# Altium schematic sheet SH4 - MICROCONTROLLER.SchDoc: Microcontroller
size B; CheckedBy: Lance Bantoto; Engineer: Wolfgang Windholtz; Organization: UW Robotics; Address1: 200 University Avenue; Address2: Waterloo; Address3: Ontario; Address4: Canada N2L 3G6; Revision: 2; SheetNumber: 4; SheetTotal: 5
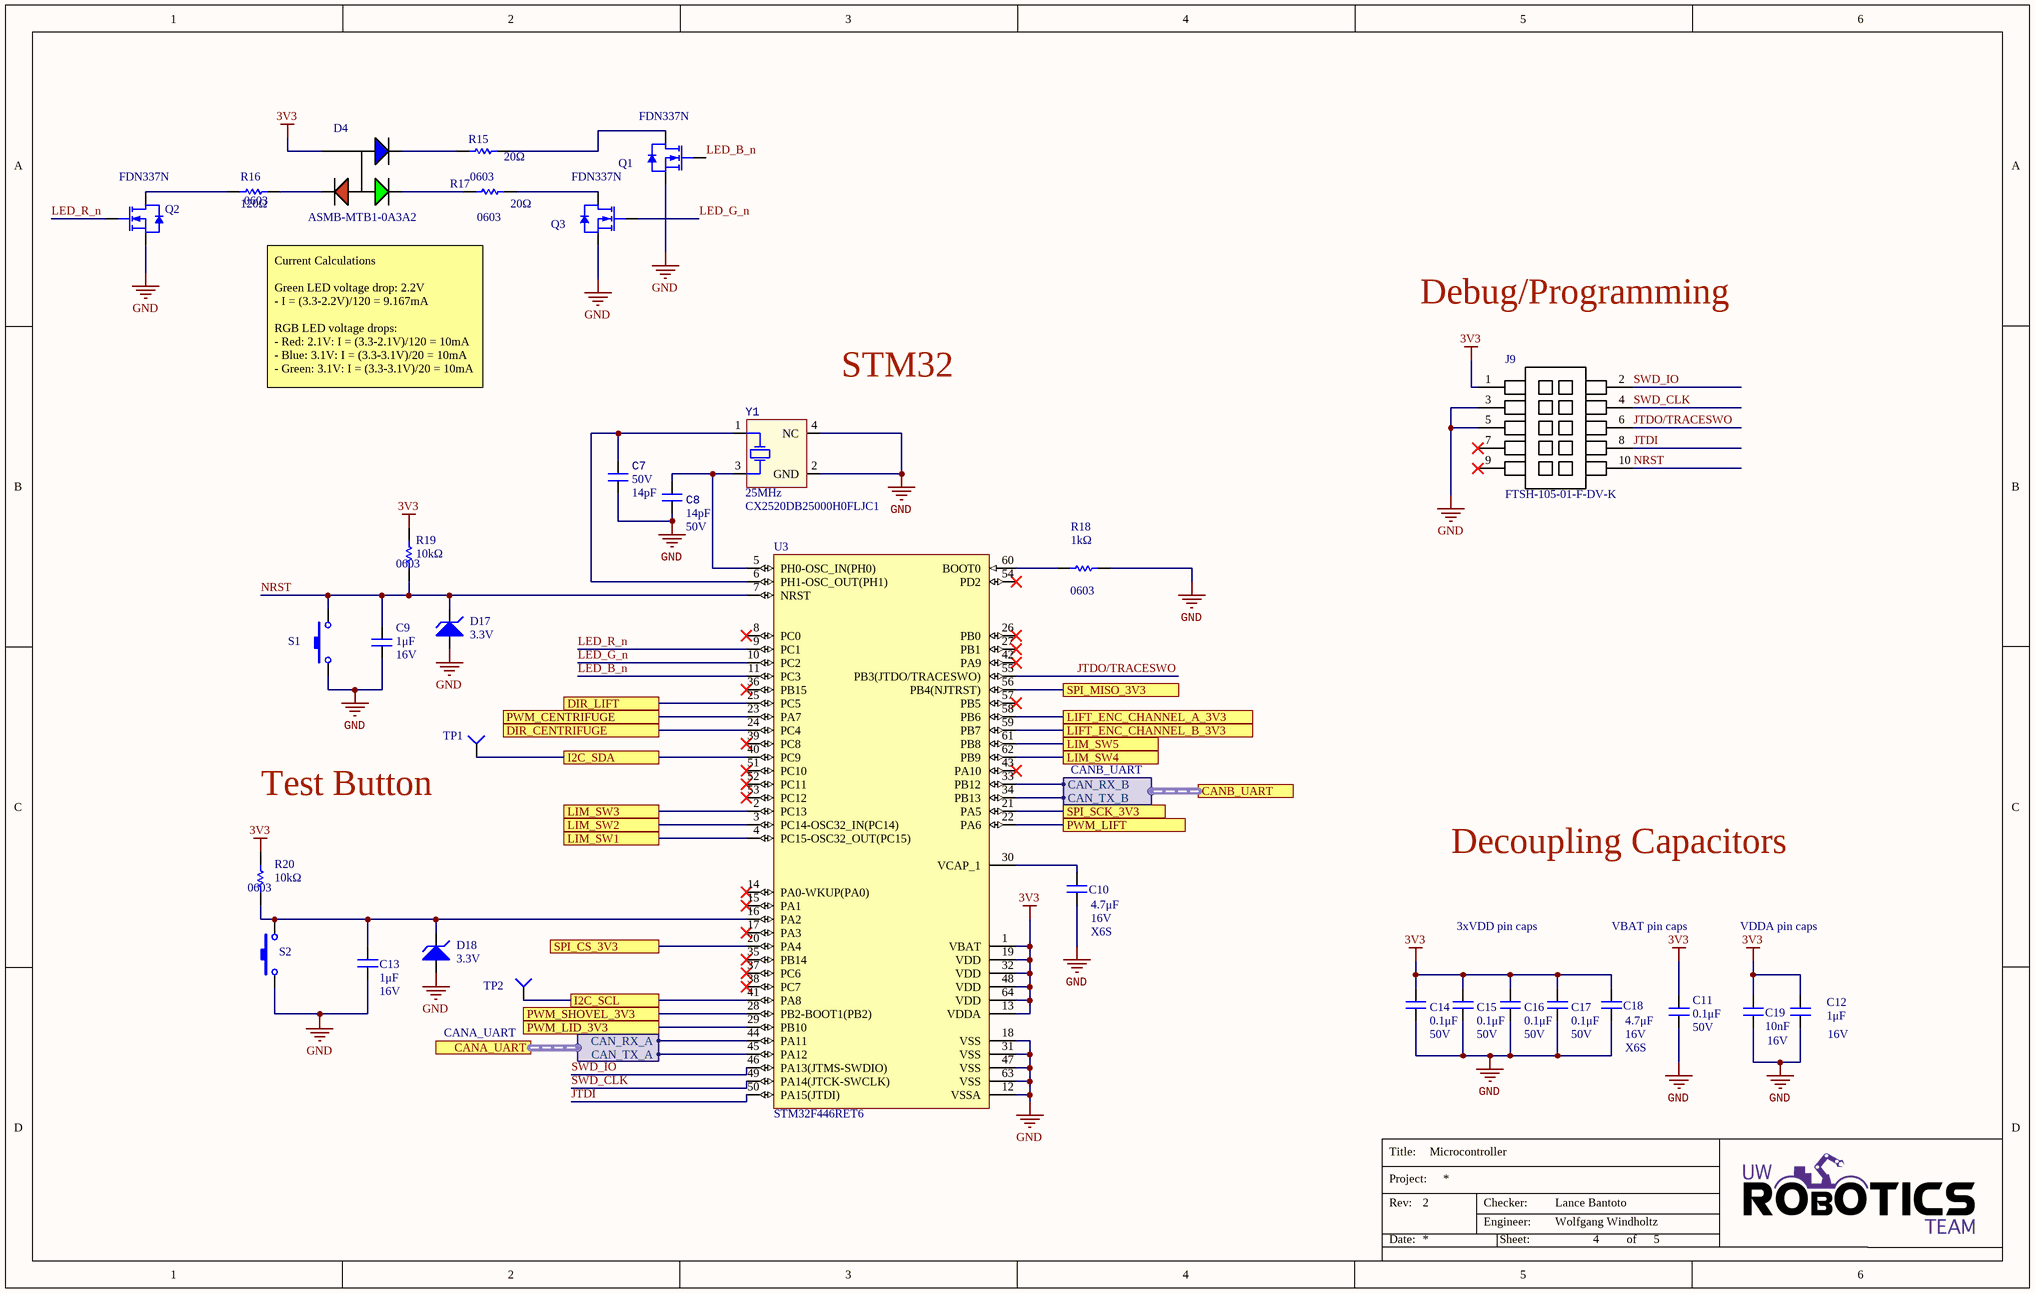
[diagram p0: SH4 - MICROCONTROLLER.SchDoc]

## Parts
C7  value 14pF  Voltage Rating: 50V  [CAP0603]  (hidden comment: CAP_14pF_50V_0603)
C8  value 14pF  Voltage Rating: 50V  [CAP0603]  (hidden comment: CAP_14pF_50V_0603)
C9  value 1μF  Voltage Rating: 16V  [CAP0603]  (hidden comment: CAP_1uF_16V_0603)
C10  value 4.7μF  Dielectric: X6S  Voltage Rating: 16V  [CAP0603]  (hidden comment: CAP_4.7uF_16V_0603)
C11  value 0.1μF  Voltage Rating: 50V  [CAP0603]  (hidden comment: CAP_0.1uF_50V_0603)
C12  value 1μF  Voltage Rating: 16V  [CAP0603]  (hidden comment: CAP_1uF_16V_0603)
C13  value 1μF  Voltage Rating: 16V  [CAP0603]  (hidden comment: CAP_1uF_16V_0603)
C14  value 0.1μF  Voltage Rating: 50V  [CAP0603]  (hidden comment: CAP_0.1uF_50V_0603)
C15  value 0.1μF  Voltage Rating: 50V  [CAP0603]  (hidden comment: CAP_0.1uF_50V_0603)
C16  value 0.1μF  Voltage Rating: 50V  [CAP0603]  (hidden comment: CAP_0.1uF_50V_0603)
C17  value 0.1μF  Voltage Rating: 50V  [CAP0603]  (hidden comment: CAP_0.1uF_50V_0603)
C18  value 4.7μF  Dielectric: X6S  Voltage Rating: 16V  [CAP0603]  (hidden comment: CAP_4.7uF_16V_0603)
C19  value 10nF  Voltage Rating: 16V  [CAP0603]  (hidden comment: CAP_10nF_0603)
D4  Manufacturer Part Number 1: ASMB-MTB1-0A3A2  [LED_RGB]  (hidden comment: LED_RGB)
D17  Reverse Standoff Voltage: 3.3V  [SOD523_UNI]  (hidden comment: ESD5Z3.3T1G)
D18  Reverse Standoff Voltage: 3.3V  [SOD523_UNI]  (hidden comment: ESD5Z3.3T1G)
J9  Manufacturer Part Number 1: FTSH-105-01-F-DV-K  [FTSH-105-01-F-DV-K-P-TR]  (hidden comment: CON_PROGRAMMING)
Q1  Manufacturer Part Number 1: FDN337N  [NMOS_SSOT-3]  (hidden comment: NMOS_30V_2.2A)
Q2  Manufacturer Part Number 1: FDN337N  [NMOS_SSOT-3]  (hidden comment: NMOS_30V_2.2A)
Q3  Manufacturer Part Number 1: FDN337N  [NMOS_SSOT-3]  (hidden comment: NMOS_30V_2.2A)
R15  value 20Ω  Package/Footprint: 0603  [RESC0603]  (hidden comment: RES_20Ω_0603_5%)
R16  value 120Ω  Package/Footprint: 0603  [RESC0603]  (hidden comment: RES_120Ω_0603)
R17  value 20Ω  Package/Footprint: 0603  [RESC0603]  (hidden comment: RES_20Ω_0603_5%)
R18  value 1kΩ  Package/Footprint: 0603  [RESC0603]  (hidden comment: RES_1kΩ_0603_5%)
R19  value 10kΩ  Package/Footprint: 0603  [RESC0603]  (hidden comment: RES_10kΩ_0603_5%)
R20  value 10kΩ  Package/Footprint: 0603  [RESC0603]  (hidden comment: RES_10kΩ_0603_5%)
S1  SW_TACTILE  [B3U-1000P]  (value not drawn)
S2  SW_TACTILE  [B3U-1000P]  (value not drawn)
TP1  TESTPOINT_1MM_CIRCLE  [TESTPOINT_CIRCLE_1MM]  (value not drawn)  (no BOM)
TP2  TESTPOINT_1MM_CIRCLE  [TESTPOINT_CIRCLE_1MM]  (value not drawn)  (no BOM)
U3  STM32F446RET6  [STM-LQFP64_L]
Y1  Frequency: 25MHz  Manufacturer Part Number 1: CX2520DB25000H0FLJC1  [SOIC254P1016X440-4N]  (hidden comment: CRYSTAL_25MHZ)

## Ports
CANA_UART (harness CANA_UART), CANB_UART (harness CANB_UART), DIR_CENTRIFUGE, DIR_LIFT, I2C_SCL, I2C_SDA, LIFT_ENC_CHANNEL_A_3V3, LIFT_ENC_CHANNEL_B_3V3, LIM_SW1, LIM_SW2, LIM_SW3, LIM_SW4, LIM_SW5, PWM_CENTRIFUGE, PWM_LID_3V3, PWM_LIFT, PWM_SHOVEL_3V3, SPI_CS_3V3, SPI_MISO_3V3, SPI_SCK_3V3

## Harnesses
CANA_UART: CAN_RX_A, CAN_TX_A
CANB_UART: CAN_RX_B, CAN_TX_B

## Nets
3V3: C11.2 C12.2 C14.2 C15.2 C16.2 C17.2 C18.2 C19.2 D4.4(COMMON_ANODE) J9.1 R19.2 R20.2 U3.1(VBAT) U3.13(VDDA) U3.19(VDD) U3.32(VDD) U3.48(VDD) U3.64(VDD)
GND: C7.1 C8.1 C9.1 C10.1 C11.1 C12.1 C13.1 C14.1 C15.1 C16.1 C17.1 C18.1 C19.1 D17.1(Anode) D18.1(Anode) J9.3 J9.5 Q1.2(SOURCE) Q2.2(SOURCE) Q3.2(SOURCE) R18.2 S1.2 S2.1 U3.12(VSSA) U3.18(VSS) U3.31(VSS) U3.47(VSS) U3.63(VSS) Y1.2(GND) Y1.4(NC)
DIR_CENTRIFUGE: U3.24(PC4) ; port DIR_CENTRIFUGE
DIR_LIFT: U3.25(PC5) ; port DIR_LIFT
I2C_SCL: TP2.1(=value) U3.41(PA8) ; port I2C_SCL
I2C_SDA: TP1.1(=value) U3.40(PC9) ; port I2C_SDA
JTDI: J9.8 U3.50(PA15(JTDI))
JTDO/TRACESWO: J9.6 U3.55(PB3(JTDO/TRACESWO))
LED_B_n: Q1.1(GATE) U3.11(PC3)
LED_G_n: Q3.1(GATE) U3.10(PC2)
LED_R_n: Q2.1(GATE) U3.9(PC1)
LIFT_ENC_CHANNEL_A_3V3: U3.58(PB6) ; port LIFT_ENC_CHANNEL_A_3V3
LIFT_ENC_CHANNEL_B_3V3: U3.59(PB7) ; port LIFT_ENC_CHANNEL_B_3V3
LIM_SW1: U3.4(PC15-OSC32_OUT(PC15)) ; port LIM_SW1
LIM_SW2: U3.3(PC14-OSC32_IN(PC14)) ; port LIM_SW2
LIM_SW3: U3.2(PC13) ; port LIM_SW3
LIM_SW4: U3.62(PB9) ; port LIM_SW4
LIM_SW5: U3.61(PB8) ; port LIM_SW5
NRST: C9.2 D17.2(Cathode) J9.10 R19.1 S1.1 U3.7(NRST)
PWM_CENTRIFUGE: U3.23(PA7) ; port PWM_CENTRIFUGE
PWM_LID_3V3: U3.29(PB10) ; port PWM_LID_3V3
PWM_LIFT: U3.22(PA6) ; port PWM_LIFT
PWM_SHOVEL_3V3: U3.28(PB2-BOOT1(PB2)) ; port PWM_SHOVEL_3V3
SPI_CS_3V3: U3.20(PA4) ; port SPI_CS_3V3
SPI_MISO_3V3: U3.56(PB4(NJTRST)) ; port SPI_MISO_3V3
SPI_SCK_3V3: U3.21(PA5) ; port SPI_SCK_3V3
SWD_CLK: J9.4 U3.49(PA14(JTCK-SWCLK))
SWD_IO: J9.2 U3.46(PA13(JTMS-SWDIO))
NetC7_2: C7.2 U3.6(PH1-OSC_OUT(PH1)) Y1.1(HOT)
NetC8_2: C8.2 U3.5(PH0-OSC_IN(PH0)) Y1.3(HOT)
NetC10_2: C10.2 U3.30(VCAP_1)
NetC13_2: C13.2 D18.2(Cathode) R20.1 S2.2 U3.16(PA2)
NetD4_1: D4.1(CATHODE_(RED)) R16.2
NetD4_2: D4.2(CATHODE_(GREEN)) R17.1
NetD4_3: D4.3(CATHODE_(BLUE)) R15.1
NetQ1_3: Q1.3(DRAIN) R15.2
NetQ2_3: Q2.3(DRAIN) R16.1
NetQ3_3: Q3.3(DRAIN) R17.2
NetR18_1: R18.1 U3.60(BOOT0)
NetU3_33: U3.33(PB12) ; port CANB_UART.CAN_RX_B
NetU3_34: U3.34(PB13) ; port CANB_UART.CAN_TX_B
NetU3_44: U3.44(PA11) ; port CANA_UART.CAN_RX_A
NetU3_45: U3.45(PA12) ; port CANA_UART.CAN_TX_A

Not connected (* = marked no-connect by the designer): J9 7* 9*; U3 8(PC0)* 14(PA0-WKUP(PA0))* 15(PA1)* 17(PA3)* 26(PB0)* 27(PB1)* 35(PB14)* 36(PB15)* 37(PC6)* 38(PC7)* 39(PC8)* 42(PA9)* 43(PA10)* 51(PC10)* 52(PC11)* 53(PC12)* 54(PD2)* 57(PB5)*

## Notes on the sheet
- Debug/Programming
- Current Calculations
  Green LED voltage drop: 2.2V
  - I = (3.3-2.2V)/120 = 9.167mA
  RGB LED voltage drops:
  - Red: 2.1V: I = (3.3-2.1V)/120 = 10mA
  - Blue: 3.1V: I = (3.3-3.1V)/20 = 10mA
  - Green: 3.1V: I = (3.3-3.1V)/20 = 10mA
- STM32
- (near TP1) Test Button
- Decoupling Capacitors
- 3xVDD pin caps
- VBAT pin caps
- VDDA pin caps
- Title:
- Project:
- Date:
- Rev:
- Checker:
- Engineer:
- Sheet:
- of

## Library data of the parts
C7 C8 = CAP_14pF_50V_0603: CAP CER 14PF 50V C0G/NP0 0603; Manufacturer 1: Samsung; Manufacturer Part Number 1: CL10C140JB8NNNC; Dielectric: C0G; Package/Footprint: 0603; Supplier 1: Digi-Key; Supplier Part Number 1: 1276-2187-1-ND; Mounting Type: SMD
C9 C13 = CAP_1uF_16V_0603: CAP CER 1UF 16V Y5V 0603; Manufacturer 1: Yageo; Manufacturer Part Number 1: CC0603ZRY5V7BB105; Package/Footprint: 0603; Dielectric: Y5V; Supplier 1: Digi-Key; Supplier Part Number 1: 311-1372-1-ND; Package: 0603 (1608 Metric); Manufacturer Part Number: CC0603ZRY5V7BB105; Dimensions: 0.063" L x 0.031" W (1.60mm x 0.80mm); Temperature Coefficient: Y5V; Mounting Type: SMD
C10 C18 = CAP_4.7uF_16V_0603: CAP CER 4.7UF 16V X6S 0603; Manufacturer Part Number 1: GRM188C81C475KE11D; Manufacturer 1: Murata Electronics; Package/Footprint: 0603; Package: 0603 (1608 Metric); Supplier Part Number 1: 490-13362-1-ND; Supplier 1: Digi-Key; Mounting Type: SMD
C11 C14-C17 = CAP_0.1uF_50V_0603: CAP CER 0.1UF 50V X7R 0603; Manufacturer Part Number 1: CC0603KRX7R9BB104; Manufacturer 1: Yageo; Package/Footprint: 0603; Temperature Coefficient: X7R; Supplier Part Number 1: 311-1344-1-ND; Supplier 1: Digi-Key; Dielectric: X7R; Mounting Type: SMD
C12 = CAP_1uF_16V_0603: CAP CER 1UF 16V Y5V 0603; Manufacturer Part Number: CC0603ZRY5V7BB105; Manufacturer 1: Yageo; Package/Footprint: 0603; Dimensions: 0.063" L x 0.031" W (1.60mm x 0.80mm); Package: 0603 (1608 Metric); Temperature Coefficient: Y5V; Supplier Part Number 1: 311-1372-1-ND; Supplier 1: Digi-Key; Manufacturer Part Number 1: CC0603ZRY5V7BB105; Dielectric: Y5V; Mounting Type: SMD
C19 = CAP_10nF_0603: CAP CER 10000PF 16V X7R 0603; Manufacturer Part Number 1: CC0603KRX7R7BB103; Manufacturer 1: Yageo; Package/Footprint: 0603; Supplier Part Number 1: 311-3369-1-ND; Supplier 1: Digi-Key; Dielectric: X7R; Mounting Type: SMD
D4 = LED_RGB: LED RGB DIFFUSED 4PLCC SMD; Manufacturer 1: Broadcom; Color: Blue,Green,Red; Lens Color: White; Viewing Angle: 115°; Lens Style: Round; Luminous Intensity: 350mcd; Dominant Wavelength: 470nm; Forward Voltage: 3.1V; Test Current: 20mA; Package/Footprint: 4-PLCC; Supplier 1: Digi-Key; Case/Package: PLCC; Number of Pins: 4; Lens Transparency: Diffused; Length: 3.2mm; Height: 1.9mm; Width: 2.8mm; Supplier Part Number 1: 516-3280-1-ND; Mounting Type: SMD
D17 D18 = ESD5Z3.3T1G: TVS DIODE 3.3V 14.1V SOD523; Manufacturer 1: ON Semiconductor; Peak Pulse Power: 158W; Number of Unidirectional Channels: 1; Min Breakdown Voltage: 5V; Power Line Protection: No; Peak Pulse Current: 11.2A; Polarity: Unidirectional; ESD Protection: Yes; Capacitance: 105pF; Max Reverse Leakage Current: 50nA; Max Power Dissipation: 200mW; Package/Footprint: SOD-523; Supplier 1: Digi-Key; Category: ESD and Circuit Protection ICs; Clamping Voltage: 14.1V; Number of Lines: 1; Breakdown Voltage: 5V; Number of Elements: 1; Max Breakdown Voltage: 5V; Reverse Breakdown Voltage: 5V; Max Surge Current: 11.2A; Direction: Unidirectional; Supplier Part Number 1: ESD5Z3.3T1GOSCT-ND; Manufacturer Part Number 1: ESD5Z3.3T1G; Mounting Type: SMD
J9 = CON_PROGRAMMING: CONN HEADER SMD 10POS 1.27MM; Manufacturer 1: Samtec; Max Current Rating: 1.75A; Supplier 1: Digi-Key; Pitch: 1.27mm; Supplier Part Number 1: SAM8796-ND; Mounting Type: SMD; Package/Footprint: SMD
Q1-Q3 = NMOS_30V_2.2A: MOSFET N-CH 30V 2.2A SUPERSOT3; Manufacturer 1: ON Semiconductor / Fairchild; Element Configuration: Single; Drain to Source Resistance: 65mR; Turn-Off Delay Time: 17ns; Gate to Source Voltage (Vgs): 8V; Rise Time: 10ns; Max Power Dissipation: 500mW; Fall Time: 4ns; Input Capacitance: 300pF; Number of Elements: 1; Threshold Voltage: 700mV; Package/Footprint: SuperSOT-3; Supplier 1: Digi-Key; Category: MOSFETs; Max Operating Temperature: 150°C; Continuous Drain Current (ID): 2.2A; Drain to Source Breakdown Voltage: 30V; Power Dissipation: 500mW; Turn-On Delay Time: 4ns; Rds On Max: 65mR; Drain to Source Voltage (Vdss): 30V; On-State Resistance: 65mR; Voltage Rating (DC): 30V; Current Rating: 2.2A; Dual Supply Voltage: 30V; Nominal Vgs: 700mV; Supplier Part Number 1: FDN337NCT-ND; Mounting Type: SMD
R15 R17 = RES_20Ω_0603_5%: RES 20 OHM 5% 1/10W 0603; Manufacturer 1: Yageo; Manufacturer Part Number 1: RC0603JR-0720RL; Package: 0603 (1608 Metric); Dimensions: 0.063" L x 0.031" W (1.60mm x 0.80mm); Supplier Part Number 1: 311-20GRCT-ND; Supplier 1: Digi-Key; Tolerance: 5%; Mounting Type: SMD
R16 = RES_120Ω_0603_5%: RES 120 OHM 5% 1/10W 0603; Manufacturer 1: Yageo; Manufacturer Part Number 1: RC0603JR-07120RL; Package: 0603 (1608 Metric); Supplier Part Number 1: 311-120GRCT-ND; Supplier 1: Digi-Key; Mounting Type: SMD
R18 = RES_1kΩ_0603_5%: RES 1K OHM 5% 1/10W 0603; Manufacturer 1: Yageo; Manufacturer Part Number 1: RC0603JR-071KL; Supplier Part Number 1: 311-1.0KGRCT-ND; Supplier 1: Digi-Key; Tolerance: 5%; Mounting Type: SMD
R19 R20 = RES_10kΩ_0603_5%: RES 10K OHM 5% 1/10W 0603; Manufacturer 1: Yageo; Manufacturer Part Number 1: RC0603JR-0710KL; Supplier 1: Digi-Key; Case Code (Metric): 1608; Tolerance: 5%; Supplier Part Number 1: 311-10KGRCT-ND; Package: 0603 (1608 Metric); Mounting Type: SMD
S1 S2 = SW_TACTILE: SWITCH TACTILE SPST-NO 0.05A 12V; Manufacturer 1: Omron Electronics Inc-EMC Div; Package/Footprint: SMD; Manufacturer Part Number 1: B3U-1000P; Supplier 1: Digi-Key; Supplier Part Number 1: SW1020CT-ND; Mounting Type: SMD
TP1 TP2 = TESTPOINT_1MM_CIRCLE: TESTPOINT 1MM CIRCLE; Part Number (MPN): *
U3 = MCU_STM32F446RET6: ARM Cortex-M4 32-bit MCU+FPU, 512 KB Flash, 128 KB Internal RAM, 50 I/Os, 64-Pin LQFP, -40 to 85 degC, Tray; I/Os (High Current): 50; Supply Voltage(Vcc) min (V): 1.7; Operating Frequency(F) (Processor speed) (MHz): 180; D/A Converter: 2; Internal RAM Size (kB): 128; FLASH Size (Prog) (kB): 512; Core: ARM Cortex-M4; ComponentLink1Description: Manufacturer URL; Package Reference: 64-Pin Low-profile Quad Flat Package, Body 10 x 10 mm, Pitch 0.5 mm; ComponentLink2URL: http://www.st.com/st-web-ui/static/active/en/resource/technical/document/datasheet/DM00141306.pdf; Packing: Tray; DatasheetVersion: Rev. 6; ComponentLink1URL: http://www.st.com/; ComponentLink2Description: Datasheet; Package Description: LQFP64; Mounting Technology: Surface Mount; Supplier 1: Digi-Key; Supplier Part Number 1: 497-15376-ND
Y1 = CRYSTAL_25MHZ: CRYSTAL 25.0000MHZ 12PF SMD; Manufacturer 1: Kyocera AVX; Load Capacitance: 12pF; Supplier 1: Digi-Key; Supplier Part Number 1: 1253-1724-1-ND; Mounting Type: SMD; Package/Footprint: SMD